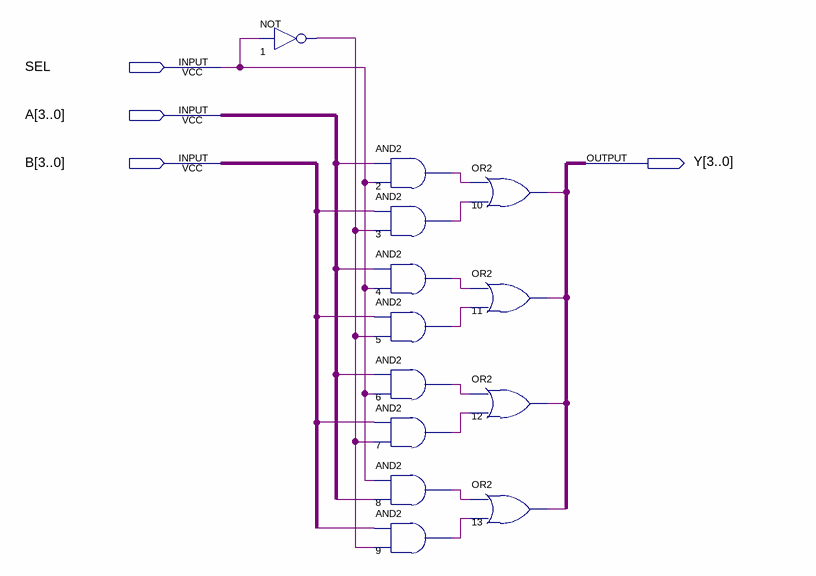
[diagram p0: schematic sheet]
// Quartus schematic multiplexador_4.bdf as structural Verilog: 13 symbols, 4 pins
module multiplexador_4 (
  input  SEL,
  input  [3:0] A,
  input  [3:0] B,
  output [3:0] Y
);

  wire n1_out, n2_out, n3_out, n4_out, n5_out, n6_out, n7_out, n8_out, n9_out;

  not u_1 (n1_out, SEL);
  and u_2 (n2_out, A[0], SEL);
  and u_3 (n3_out, B[0], n1_out);
  and u_4 (n4_out, A[1], SEL);
  and u_5 (n5_out, B[1], n1_out);
  and u_6 (n6_out, A[2], SEL);
  and u_7 (n7_out, B[2], n1_out);
  and u_8 (n8_out, SEL, A[3]);
  and u_9 (n9_out, B[3], n1_out);
  or u_10 (Y[0], n2_out, n3_out);
  or u_11 (Y[1], n4_out, n5_out);
  or u_12 (Y[2], n6_out, n7_out);
  or u_13 (Y[3], n8_out, n9_out);
endmodule
